# Altium project badgotron.PrjPcb
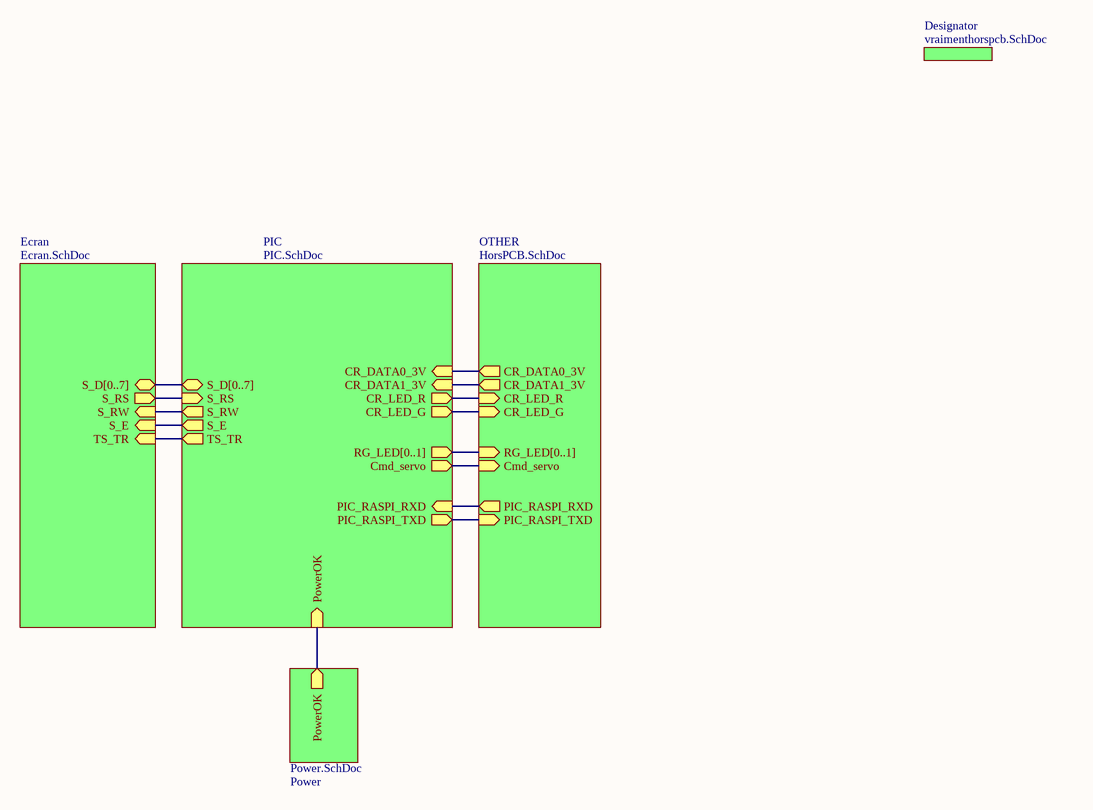
[diagram p0: Main.SchDoc]
6 sheets, 71 parts. Net scope: hierarchical (ports join the sheet entries above them; power ports are global).
Sheets:
  Main.SchDoc
    Designator = vraimenthorspcb.SchDoc
    Ecran = Ecran.SchDoc
    PIC = PIC.SchDoc
    OTHER = HorsPCB.SchDoc
    Power = Power.SchDoc

## Sheet Main.SchDoc
size A4

### Sub-sheets
Designator = vraimenthorspcb.SchDoc: no entries
Ecran = Ecran.SchDoc: S_D[0..7] (bidir), S_RS (out), S_RW (in), S_E (in), TS_TR (in)
OTHER = HorsPCB.SchDoc: CR_DATA0_3V (out), CR_DATA1_3V (out), CR_LED_R (in), CR_LED_G (in), RG_LED[0..1] (in), Cmd_servo (in), PIC_RASPI_TXD (in), PIC_RASPI_RXD (out)
PIC = PIC.SchDoc: CR_DATA0_3V (in), CR_DATA1_3V (in), CR_LED_R (out), CR_LED_G (out), RG_LED[0..1] (out), Cmd_servo (out), PowerOK (in), S_RS (in), S_RW (out), S_E (out), TS_TR (out), S_D[0..7] (bidir), PIC_RASPI_RXD (in), PIC_RASPI_TXD (out)
Power = Power.SchDoc: PowerOK (out)

### Nets
Cmd_servo: sheet PIC/Cmd_servo, sheet OTHER/Cmd_servo
CR_DATA0_3V: sheet PIC/CR_DATA0_3V, sheet OTHER/CR_DATA0_3V
CR_DATA1_3V: sheet PIC/CR_DATA1_3V, sheet OTHER/CR_DATA1_3V
CR_LED_G: sheet PIC/CR_LED_G, sheet OTHER/CR_LED_G
CR_LED_R: sheet PIC/CR_LED_R, sheet OTHER/CR_LED_R
PIC_RASPI_RXD: sheet PIC/PIC_RASPI_RXD, sheet OTHER/PIC_RASPI_RXD
PIC_RASPI_TXD: sheet PIC/PIC_RASPI_TXD, sheet OTHER/PIC_RASPI_TXD
PowerOK: sheet PIC/PowerOK, sheet Power/PowerOK
S_E: sheet Ecran/S_E, sheet PIC/S_E
S_RS: sheet Ecran/S_RS, sheet PIC/S_RS
S_RW: sheet Ecran/S_RW, sheet PIC/S_RW
TS_TR: sheet Ecran/TS_TR, sheet PIC/TS_TR
(unnamed): sheet Ecran/S_D[0..7], sheet PIC/S_D[0..7]
(unnamed): sheet PIC/RG_LED[0..1], sheet OTHER/RG_LED[0..1]

## Sheet vraimenthorspcb.SchDoc
size A
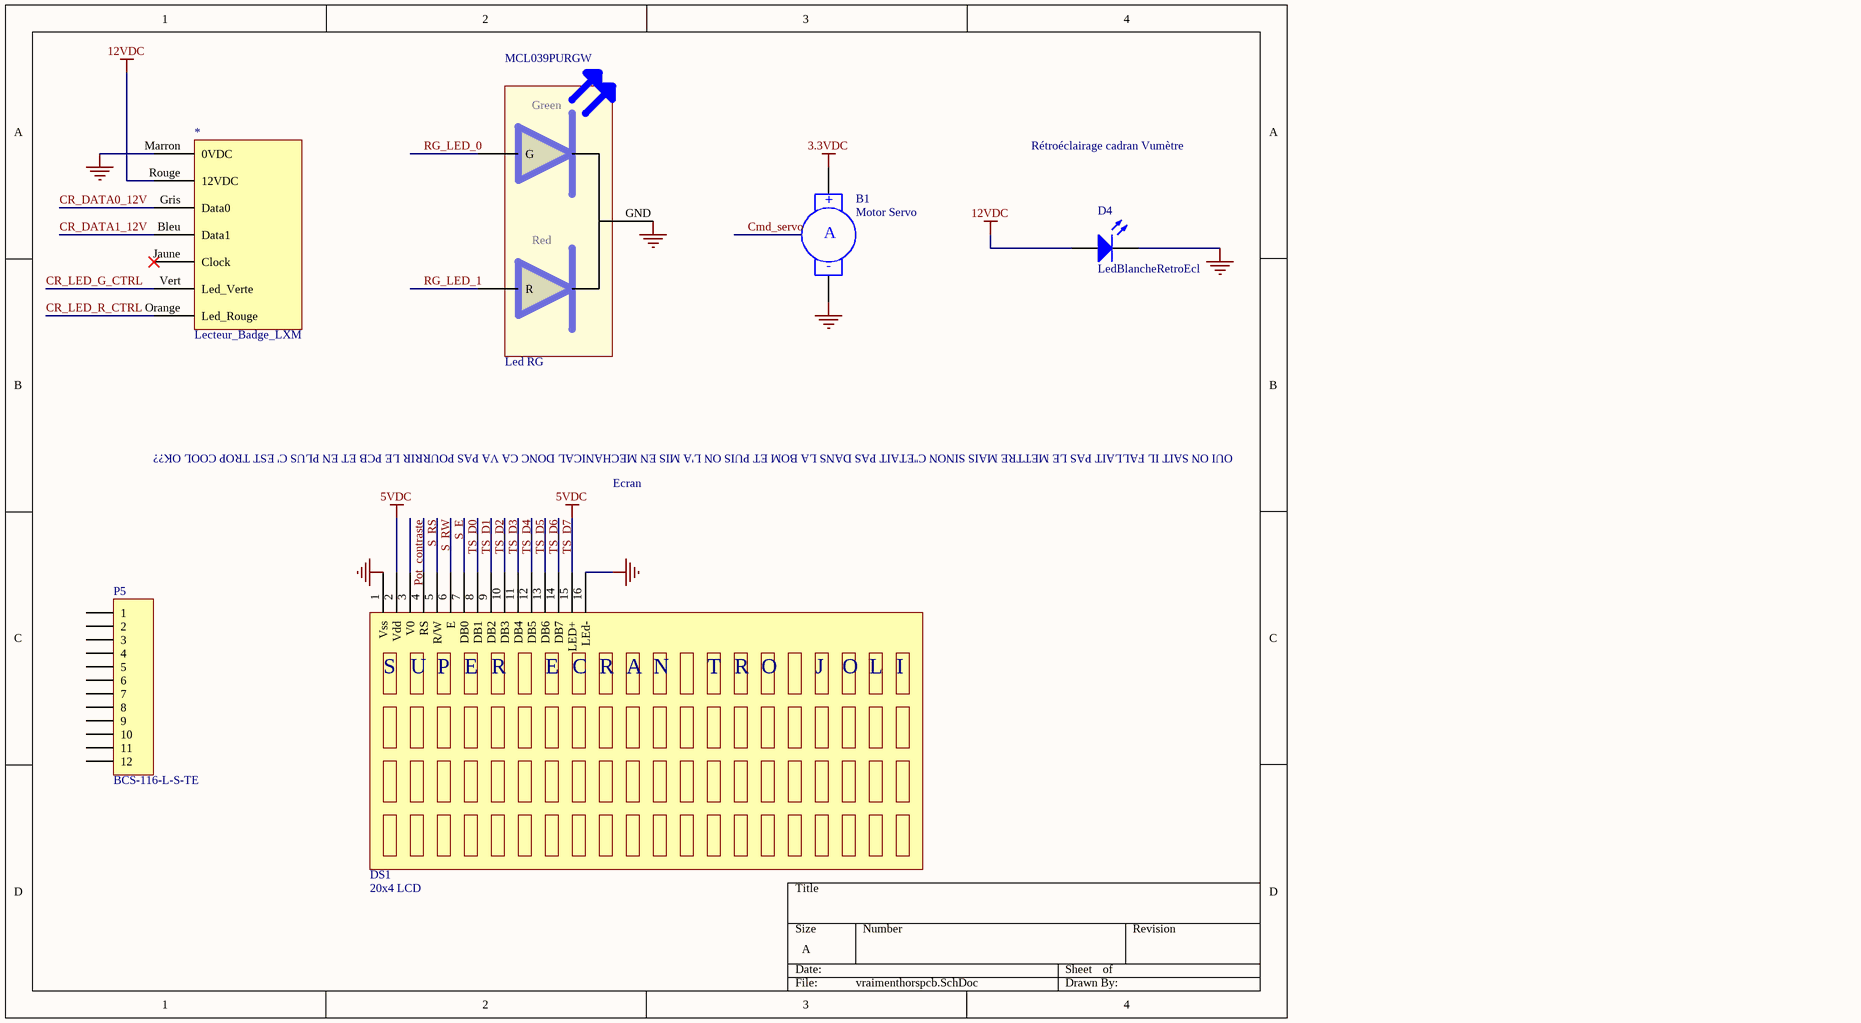
[diagram p1: vraimenthorspcb.SchDoc]

### Parts
*  Lecteur_Badge_LXM  (mechanical)
B1  Motor Servo  [RAD-0.4]  (mechanical)
D4  LedBlancheRetroEcl  [LED-0]  (mechanical)
DS1  20x4 LCD  (mechanical)
MCL039PURGW  Led RG  (mechanical)
P5  BCS-116-L-S-TE  [HDR1X12]  (mechanical)

### Nets
3.3VDC: B1.1(+)
5VDC: DS1.2(Vdd) DS1.15(LED+)
12VDC: *.Rouge(12VDC) D4.1(A)
GND: *.Marron(0VDC) B1.2(-) D4.2(K) DS1.1(Vss) DS1.16(LEd-) MCL039PURGW.GND
CR_DATA0_12V: *.Gris(Data0)
CR_DATA1_12V: *.Bleu(Data1)
CR_LED_G_CTRL: *.Vert(Led_Verte)
CR_LED_R_CTRL: *.Orange(Led_Rouge)
Pot_contraste: DS1.3(V0)
RG_LED_0: MCL039PURGW.G
RG_LED_1: MCL039PURGW.R
S_E: DS1.6(E)
S_RS: DS1.4(RS)
S_RW: DS1.5(R/W)
TS_D0: DS1.7(DB0)
TS_D1: DS1.8(DB1)
TS_D2: DS1.9(DB2)
TS_D3: DS1.10(DB3)
TS_D4: DS1.11(DB4)
TS_D5: DS1.12(DB5)
TS_D6: DS1.13(DB6)
TS_D7: DS1.14(DB7)

Not connected (* = marked no-connect by the designer): * Jaune(Clock)*; P5 1 2 3 4 5 6 7 8 9 10 11 12

### Notes on the sheet
- Rétroéclairage cadran Vumètre
- Ecran
- OUI ON SAIT IL FALLAIT PAS LE METTRE MAIS SINON C''ETAIT PAS DANS LA BOM ET PUIS ON L'A MIS EN MECHANICAL DONC CA VA PAS POURRIR LE PCB ET EN PLUS C' EST TROP COOL OK??
- (in symbol MC42008A6W-FPTLW) S; U; P; R; C; A; N; T; O; J; L; I
- (in symbol MCL039PURGW) Green; Red
- (in symbol Motor Servo) A

### Library data of the parts
* = Lecteur_Badge_LXM: Fournisseur: Gregoire; Fabricant: Stid-Security; Ref.Fournisseur: :); Ref.Fabricant: LXM_WIEGAND44b
B1 = Motor Servo: Servo Motor; Fournisseur: Olimex; Ref.Fournisseur: MS-R-1.3-9; Fabricant: Olimex; Ref.Fabricant: MS-R-1.3-9
D4 = LED0: LED Blanche retro vumetre; Fournisseur: BARBIE; Fabricant: N/A; Ref.Fabricant: N/A; Ref.Fournisseur: N/A
DS1 = MC42008A6W-FPTLW: Fournisseur: Farnell; Ref.Fournisseur: 2606880; Fabricant: Midas; Ref.Fabricant: MC42008A6W-FPTLW
MCL039PURGW = MCL039PURGW: Fournisseur: Farnell; Fabricant: Multicomp; Ref.Fournisseur: 1581194; Ref.Fabricant: MCL039PURGW
P5 = Header 12: Header, 12-Pin; Fournisseur: Farnell; Ref.Fournisseur: 1667483; Fabricant: Samtec; Ref.Fabricant: BCS-116-L-S-TE

## Sheet Ecran.SchDoc
size A
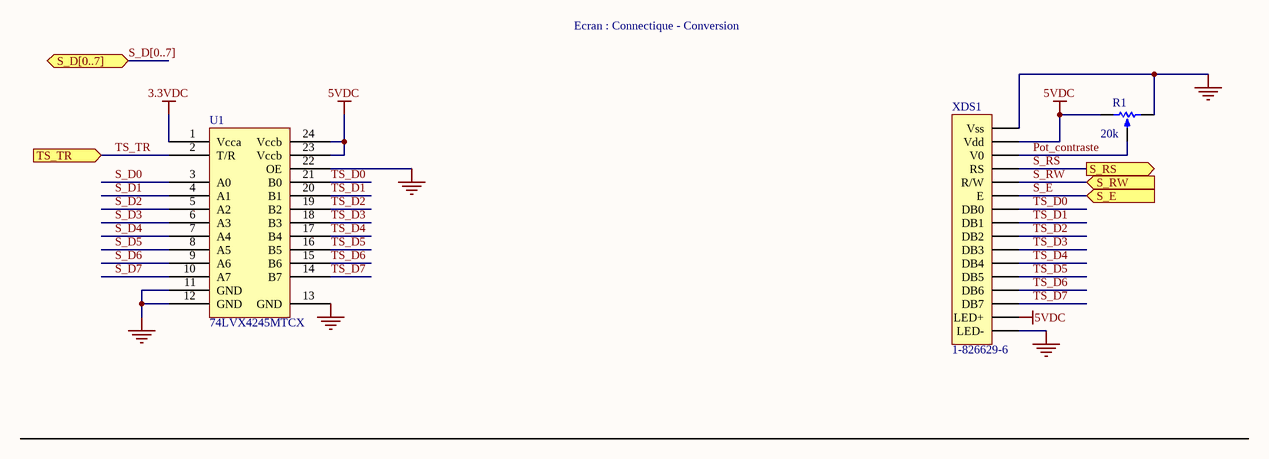
[diagram p2: Ecran.SchDoc]

### Parts
R1  20k  [VR5]
U1  74LVX4245MTCX
XDS1  1-826629-6  [HDR1X16]

### Ports
S_D[0..7] (bidir), S_E (in), S_RS (out), S_RW (in), TS_TR (in)

### Nets
3.3VDC: U1.1(Vcca)
5VDC: R1.1(TOP) U1.23(Vccb) U1.24(Vccb) XDS1.2(Vdd) XDS1.15(LED+)
GND: R1.2(BOT) U1.11(GND) U1.12(GND) U1.13(GND) U1.22(OE) XDS1.1(Vss) XDS1.16(LED-)
Pot_contraste: R1.3(TAP) XDS1.3(V0)
S_D0: U1.3(A0)
S_D1: U1.4(A1)
S_D2: U1.5(A2)
S_D3: U1.6(A3)
S_D4: U1.7(A4)
S_D5: U1.8(A5)
S_D6: U1.9(A6)
S_D7: U1.10(A7)
S_E: XDS1.6(E) ; port S_E
S_RS: XDS1.4(RS) ; port S_RS
S_RW: XDS1.5(R/W) ; port S_RW
TS_D0: U1.21(B0) XDS1.7(DB0)
TS_D1: U1.20(B1) XDS1.8(DB1)
TS_D2: U1.19(B2) XDS1.9(DB2)
TS_D3: U1.18(B3) XDS1.10(DB3)
TS_D4: U1.17(B4) XDS1.11(DB4)
TS_D5: U1.16(B5) XDS1.12(DB5)
TS_D6: U1.15(B6) XDS1.13(DB6)
TS_D7: U1.14(B7) XDS1.14(DB7)
TS_TR: U1.2(T/R) ; port TS_TR

### Buses and harness runs
bus S_D[0..7] = port S_D[0..7]

### Notes on the sheet
- Ecran : Connectique - Conversion

### Library data of the parts
R1 = RPot: Potentiometer; Fournisseur: Farnell; Ref.Fournisseur: 9609822; Ref.Fabricant: M63S203KB40; Fabricant: VISHAY
U1 = 74LVX4245MTCX: Bus Transceiver; Fabricant: ON SEMICONDUCTOR; Fournisseur: Farnell; Ref.Fournisseur: 1467357; Ref.Fabricant: 74LVX4245MTCX
XDS1 = Header 16: Header, 16-Pin; Fournisseur: Farnell; Fabricant: AMP-TE CONNECTIVITY; Ref.Fournisseur: 1248124; Ref.Fabricant: 1-826629-6

## Sheet PIC.SchDoc
size A4
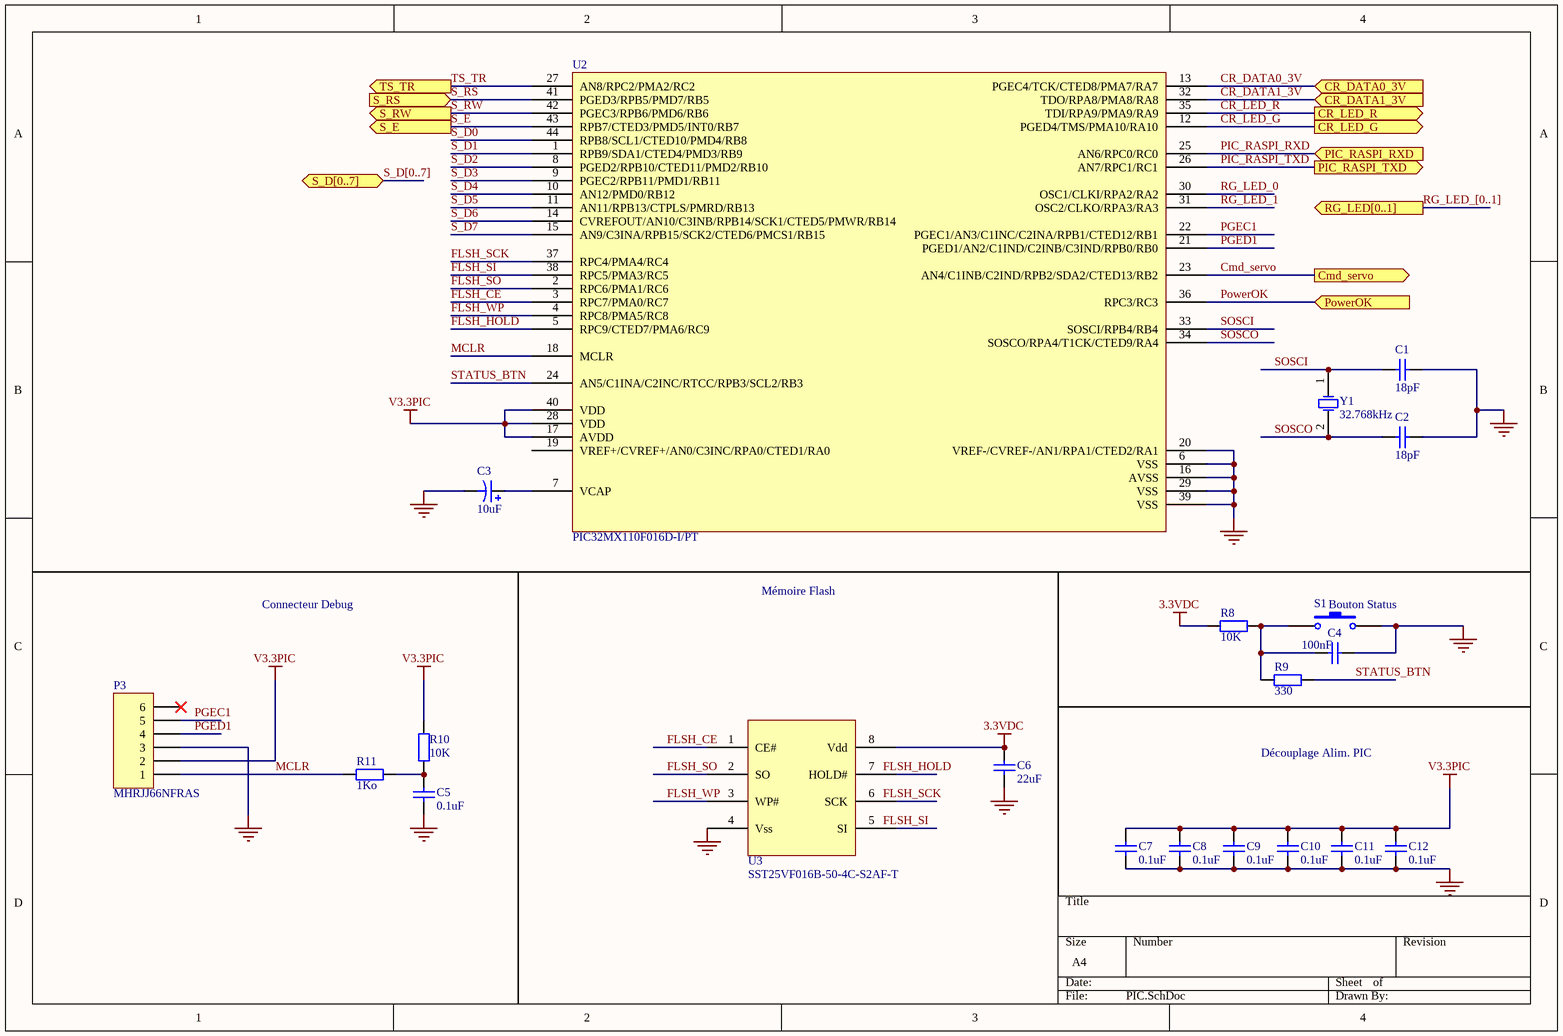
[diagram p3: PIC.SchDoc]

### Parts
C1  18pF  [RAD-0.3]
C2  18pF  [RAD-0.3]
C3  10uF  [RB7.6-15]
C4  100nF  [RAD-0.3]
C5  0.1uF  [RAD-0.3]
C6  22uF  [RAD-0.3]
C7  0.1uF  [RAD-0.3]
C8  0.1uF  [RAD-0.3]
C9  0.1uF  [RAD-0.3]
C10  0.1uF  [RAD-0.3]
C11  0.1uF  [RAD-0.3]
C12  0.1uF  [RAD-0.3]
P3  MHRJJ66NFRAS  [HDR1X6]
R8  10K  [AXIAL-0.4]
R9  330  [AXIAL-0.4]
R10  10K  [AXIAL-0.4]
R11  1Ko  [AXIAL-0.4]
S1  Bouton Status  [SPST-2]  (value not drawn)
U2  PIC32MX110F016D-I/PT
U3  SST25VF016B-50-4C-S2AF-T
Y1  32.768kHz  [R38]

### Ports
Cmd_servo (out), CR_DATA0_3V (in), CR_DATA1_3V (in), CR_LED_G (out), CR_LED_R (out), PIC_RASPI_RXD (in), PIC_RASPI_TXD (out), PowerOK (in), RG_LED[0..1] (out), S_D[0..7] (bidir), S_E (out), S_RS (in), S_RW (out), TS_TR (out)

### Nets
3.3VDC: C6.2 R8.1 U3.8(Vdd)
GND: C1.1 C2.1 C3.2 C4.2 C5.1 C6.1 C7.1 C8.1 C9.1 C10.1 C11.1 C12.1 P3.3 S1.2 U2.6(VSS) U2.16(AVSS) U2.20(VREF-/CVREF-/AN1/RPA1/CTED2/RA1) U2.29(VSS) U2.39(VSS) U3.4(Vss)
V3.3PIC: C7.2 C8.2 C9.2 C10.2 C11.2 C12.2 P3.2 R10.2 U2.17(AVDD) U2.28(VDD) U2.40(VDD)
Cmd_servo: U2.23(AN4/C1INB/C2IND/RPB2/SDA2/CTED13/RB2) ; port Cmd_servo
CR_DATA0_3V: U2.13(PGEC4/TCK/CTED8/PMA7/RA7) ; port CR_DATA0_3V
CR_DATA1_3V: U2.32(TDO/RPA8/PMA8/RA8) ; port CR_DATA1_3V
CR_LED_G: U2.12(PGED4/TMS/PMA10/RA10) ; port CR_LED_G
CR_LED_R: U2.35(TDI/RPA9/PMA9/RA9) ; port CR_LED_R
FLSH_CE: U2.3(RPC7/PMA0/RC7) U3.1(CE#)
FLSH_HOLD: U2.5(RPC9/CTED7/PMA6/RC9)
FLSH_SCK: U2.37(RPC4/PMA4/RC4)
FLSH_SI: U2.38(RPC5/PMA3/RC5)
FLSH_SO: U2.2(RPC6/PMA1/RC6) U3.2(SO)
FLSH_WP: U2.4(RPC8/PMA5/RC8) U3.3(WP#)
MCLR: P3.1 R11.2 U2.18(MCLR)
PGEC1: P3.5 U2.22(PGEC1/AN3/C1INC/C2INA/RPB1/CTED12/RB1)
PGED1: P3.4 U2.21(PGED1/AN2/C1IND/C2INB/C3IND/RPB0/RB0)
PIC_RASPI_RXD: U2.25(AN6/RPC0/RC0) ; port PIC_RASPI_RXD
PIC_RASPI_TXD: U2.26(AN7/RPC1/RC1) ; port PIC_RASPI_TXD
PowerOK: U2.36(RPC3/RC3) ; port PowerOK
RG_LED_0: U2.30(OSC1/CLKI/RPA2/RA2)
RG_LED_1: U2.31(OSC2/CLKO/RPA3/RA3)
S_D0: U2.44(RPB8/SCL1/CTED10/PMD4/RB8)
S_D1: U2.1(RPB9/SDA1/CTED4/PMD3/RB9)
S_D2: U2.8(PGED2/RPB10/CTED11/PMD2/RB10)
S_D3: U2.9(PGEC2/RPB11/PMD1/RB11)
S_D4: U2.10(AN12/PMD0/RB12)
S_D5: U2.11(AN11/RPB13/CTPLS/PMRD/RB13)
S_D6: U2.14(CVREFOUT/AN10/C3INB/RPB14/SCK1/CTED5/PMWR/RB14)
S_D7: U2.15(AN9/C3INA/RPB15/SCK2/CTED6/PMCS1/RB15)
S_E: U2.43(RPB7/CTED3/PMD5/INT0/RB7) ; port S_E
S_RS: U2.41(PGED3/RPB5/PMD7/RB5) ; port S_RS
S_RW: U2.42(PGEC3/RPB6/PMD6/RB6) ; port S_RW
SOSCI: C1.2 U2.33(SOSCI/RPB4/RB4) Y1.1(OSC1)
SOSCO: C2.2 U2.34(SOSCO/RPA4/T1CK/CTED9/RA4) Y1.2(OSC2)
STATUS_BTN: R9.2 U2.24(AN5/C1INA/C2INC/RTCC/RPB3/SCL2/RB3)
TS_TR: U2.27(AN8/RPC2/PMA2/RC2) ; port TS_TR
NetC3_1: C3.1 U2.7(VCAP)
NetC4_1: C4.1 R8.2 R9.1 S1.1
NetC5_2: C5.2 R10.1 R11.1

Not connected (* = marked no-connect by the designer): P3 6*; U2 19(VREF+/CVREF+/AN0/C3INC/RPA0/CTED1/RA0); U3 5(SI) 6(SCK) 7(HOLD#)

### Buses and harness runs
bus RG_LED_[0..1] = port RG_LED[0..1]
bus S_D[0..7] = port S_D[0..7]

### Notes on the sheet
- Connecteur Debug
- Mémoire Flash
- (near S1) Bouton Status
- Découplage Alim. PIC
- Labels drawn without touching a wire or pin: FLSH_HOLD, FLSH_SCK, FLSH_SI

### Library data of the parts
C1 C2 = Cap: Capacitor; Fournisseur: Farnell; Fabricant: AVX; Ref.Fabricant: 02013A180JAT2A; Ref.Fournisseur: 1740563
C3 = Cap Pol1: Fournisseur: Farnell; Ref.Fournisseur: 2353238; Ref.Fabricant: TL3C106K025C0450..; Fabricant: VISHAY
C4 = Cap: Capacitor; Fournisseur: Farnell; Ref.Fournisseur: 2812613; Fabricant: WURTH ELECTRONIK; Ref.Fabricant: 885342211005; Value: 100nF
C5 C7-C12 = Cap: Capacitor; Fournisseur: Farnell; Fabricant: Multicomp; Ref.Fabricant: MCY4C3B104M160CT; Ref.Fournisseur: 2310273; Value: 0.1uF
C6 = Cap: Cout_Reg_3.3v; Fournisseur: Farnell; Fabricant: AVX; Ref.Fabricant: 12103D226KAT2A; Ref.Fournisseur: 1833829; Value: 22uF
P3 = Header 6: PortRJ12_debug; Fournisseur: Farnell; Fabricant: MH Connectors; Ref.Fournisseur: 3938372; Ref.Fabricant: MHRJJ66NFRAS
R8 = Res2: Resistor; Fabricant: TE CONNECTIVITY; Fournisseur: Farnell; Ref.Fabricant: CPF0201D10KC1; Ref.Fournisseur: 2117887
R9 = Res2: Resistor; Fabricant: TE Connectivity; Fournisseur: Farnell; Ref.Fabricant: RN73C1J232RBTDF; Ref.Fournisseur: 2687973
R10 = Res2: Resistor; Fournisseur: Farnell; Fabricant: TE CONNECTIVITY; Ref.Fabricant: CPF0201D10KC1; Ref.Fournisseur: 2117887; Value: 10k
R11 = Res2: Resistor; Value: 1K; Fournisseur: Farnell; Fabricant: TE CONNECTIVITY; Ref.Fabricant: CPF0201D1K0E1; Ref.Fournisseur: 2117780
S1 = SW-PB: Switch; Fournisseur: Farnell; Fabricant: RAFI; Ref.Fabricant: 1.10.001.001/0205; Ref.Fournisseur: 9927360
U2 = PIC32: Fournisseur: Farnell; Fabricant: MICROCHIP; Ref.Fournisseur: 2057068; Ref.Fabricant: PIC32MX110F016D-I/PT
U3 = Memoire: FLASH; Fournisseur: Farnell; Fabricant: Microchip; Ref.Fournisseur: 2810109; Ref.Fabricant: SST25VF016B-50-4C-S2AF-T
Y1 = XTAL: Crystal Oscillator; Fournisseur: Farnell; Fabricant: ABRACON; Ref.Fabricant: ABS07-32.768KHZ-7-T; Ref.Fournisseur: 1838935

## Sheet HorsPCB.SchDoc
size A4
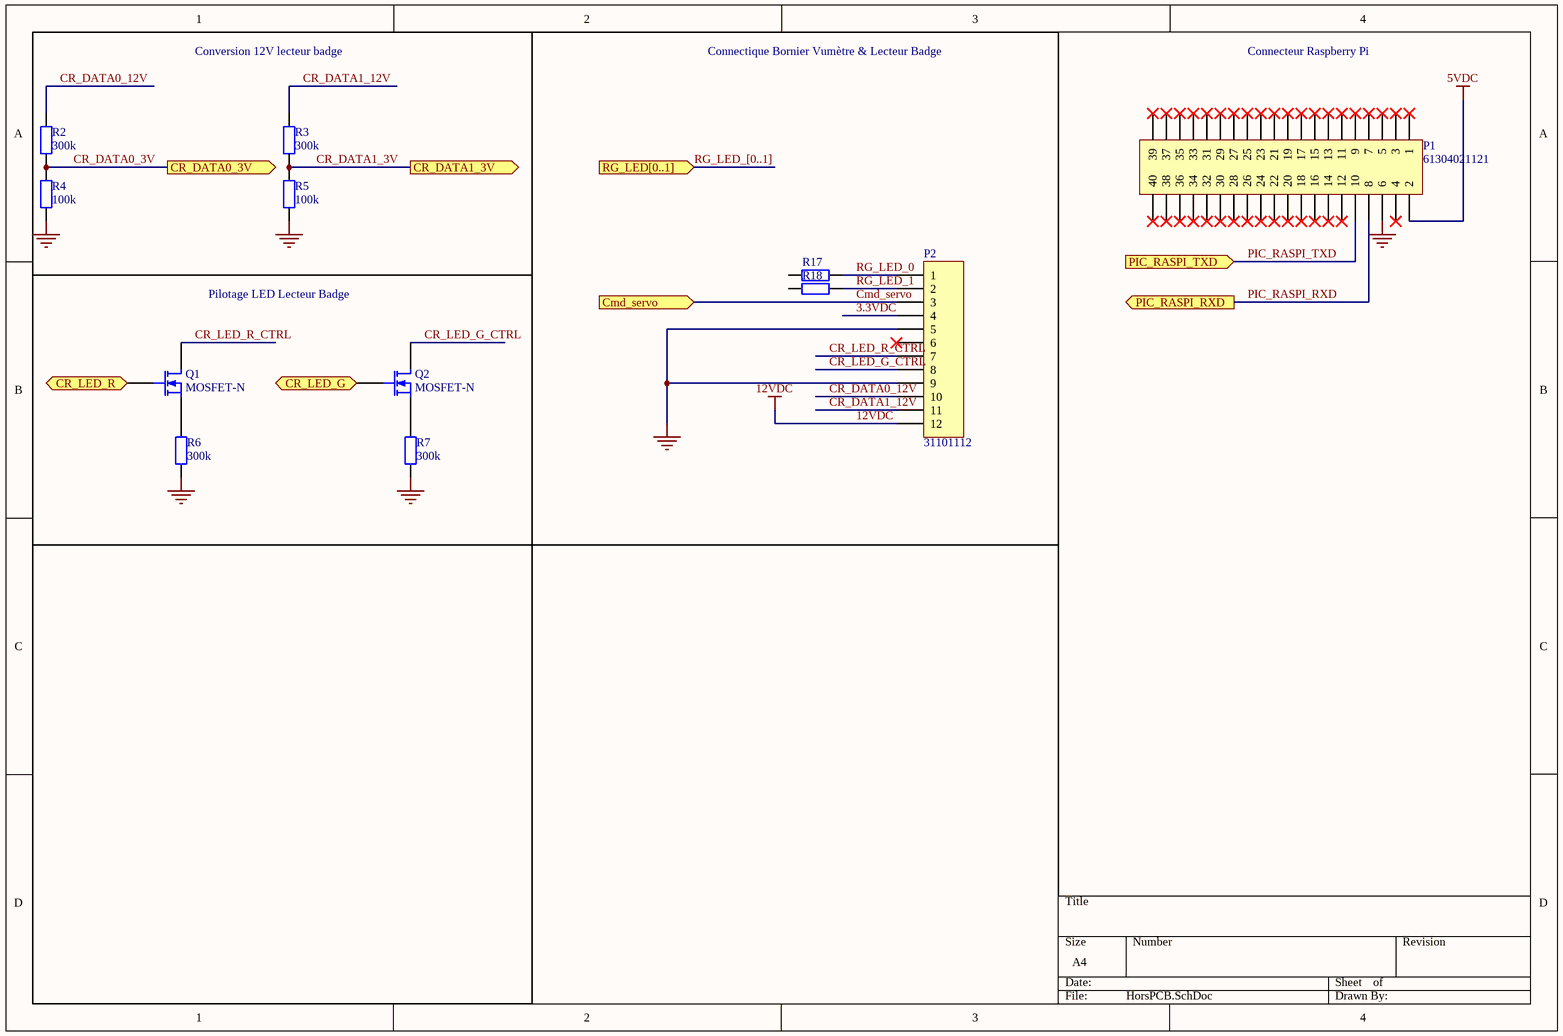
[diagram p4: HorsPCB.SchDoc]

### Parts
P1  61304021121  [HDR2X20]
P2  31101112  [HDR1X12]
Q1  MOSFET-N  [E3]
Q2  MOSFET-N  [E3]
R2  300k  [AXIAL-0.4]
R3  300k  [AXIAL-0.4]
R4  100k  [AXIAL-0.4]
R5  100k  [AXIAL-0.4]
R6  300k  [AXIAL-0.4]
R7  300k  [AXIAL-0.4]
R17  60.4  [AXIAL-0.4]  (value not drawn)
R18  75  [AXIAL-0.4]  (value not drawn)

### Ports
Cmd_servo (in), CR_DATA0_3V (out), CR_DATA1_3V (out), CR_LED_G (in), CR_LED_R (in), PIC_RASPI_RXD (out), PIC_RASPI_TXD (in), RG_LED[0..1] (in)

### Nets
5VDC: P1.2
12VDC: P2.12
GND: P1.6 P2.5 P2.9 R4.1 R5.1 R6.1 R7.1
3.3VDC: P2.4
Cmd_servo: P2.3 ; port Cmd_servo
CR_DATA0_3V: R2.1 R4.2 ; port CR_DATA0_3V
CR_DATA0_12V: P2.10 R2.2
CR_DATA1_3V: R3.1 R5.2 ; port CR_DATA1_3V
CR_DATA1_12V: P2.11 R3.2
CR_LED_G: Q2.2(G) ; port CR_LED_G
CR_LED_G_CTRL: P2.8 Q2.1(D)
CR_LED_R: Q1.2(G) ; port CR_LED_R
CR_LED_R_CTRL: P2.7 Q1.1(D)
PIC_RASPI_RXD: P1.8 ; port PIC_RASPI_RXD
PIC_RASPI_TXD: P1.10 ; port PIC_RASPI_TXD
RG_LED_0: P2.1 R17.2
RG_LED_1: P2.2 R18.2
NetQ1_3: Q1.3(S) R6.2
NetQ2_3: Q2.3(S) R7.2

Not connected (* = marked no-connect by the designer): P1 1* 3* 4* 5* 7* 9* 11* 12* 13* 14* 15* 16* 17* 18* 19* 20* 21* 22* 23* 24* 25* 26* 27* 28* 29* 30* 31* 32* 33* 34* 35* 36* 37* 38* 39* 40*; P2 6*; R17 1; R18 1

### Buses and harness runs
bus RG_LED_[0..1] = port RG_LED[0..1]

### Notes on the sheet
- Conversion 12V lecteur badge
- Connectique Bornier Vumètre & Lecteur Badge
- Connecteur Raspberry Pi
- Pilotage LED Lecteur Badge

### Library data of the parts
P1 = Header 20X2: Header, 20-Pin, Dual row; Fournisseur: Farnell; Fabricant: WURTH ELECTRONIK; Ref.Fournisseur: 2356148; Ref.Fabricant: 61304021121
P2 = Header 12: Header, 12-Pin; Fournisseur: Farnell; Fabricant: METZ CONNECT; Ref.Fournisseur: 1909750; Ref.Fabricant: 31101112
Q1 Q2 = MOSFET-N: N-Channel MOSFET; Fournisseur: Farnell; Ref.Fournisseur: 2760371; Fabricant: Nexperia; Ref.Fabricant: BUK7M42-60EX
R2 R3 R6 R7 = Res2: Resistor; Fournisseur: Farnell; Ref.Fournisseur: 2074433; Fabricant: MULTICOMP; Ref.Fabricant: MCSR08X3003FTL; Value: 300k
R4 R5 = Res2: Resistor; Fournisseur: Farnell; Ref.Fournisseur: 2447226; Fabricant: MULTICOMP; Ref.Fabricant: MCWR06X1003FTL; Value: 100k
R17 = Res2: Resistor; Value: 60.4o; Fournisseur: Farnell; Fabricant: TE CONNECTIVITY; Ref.Fabricant: RP73PF1E60R4BTDF; Ref.Fournisseur: 2838800
R18 = Res2: Resistor; Value: 75o; Fournisseur: Farnell; Fabricant: TE CONNECTIVITY; Ref.Fabricant: CPF0805B75RE1; Ref.Fournisseur: 1697415

## Sheet Power.SchDoc
size A4
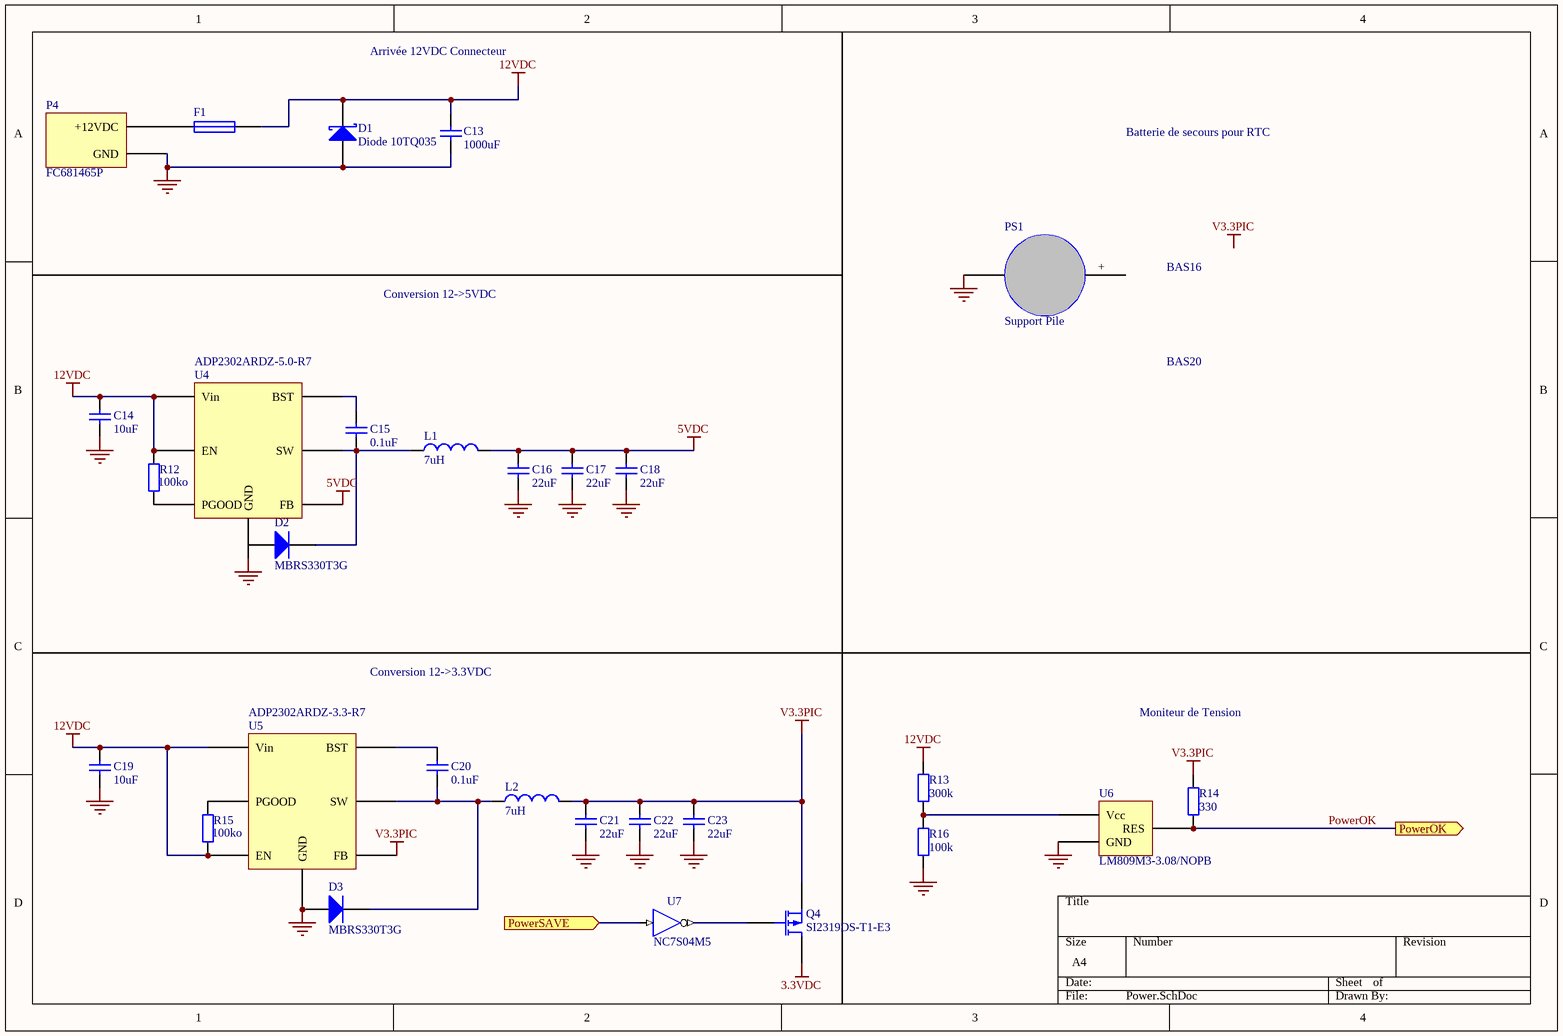
[diagram p5: Power.SchDoc]

### Parts
C13  1000uF  [RAD-0.3]
C14  10uF  [RAD-0.3]
C15  0.1uF  [RAD-0.3]
C16  22uF  [RAD-0.3]
C17  22uF  [RAD-0.3]
C18  22uF  [RAD-0.3]
C19  10uF  [RAD-0.3]
C20  0.1uF  [RAD-0.3]
C21  22uF  [RAD-0.3]
C22  22uF  [RAD-0.3]
C23  22uF  [RAD-0.3]
D1  Diode 10TQ035  [TO-220AC]
D2  MBRS330T3G  [SMC]
D3  MBRS330T3G  [SMC]
F1  Fuse 1  [PIN-W2/E2.8]  (value not drawn)
L1  7uH  [0402-A]
L2  7uH  [0402-A]
P4  FC681465P
PS1  Support Pile
Q4  SI2319DS-T1-E3  [E3]
R12  100ko  [AXIAL-0.4]
R13  300k  [AXIAL-0.4]
R14  330  [AXIAL-0.4]
R15  100ko  [AXIAL-0.4]
R16  100k  [AXIAL-0.4]
U4  ADP2302ARDZ-5.0-R7
U5  ADP2302ARDZ-3.3-R7
U6  LM809M3-3.08/NOPB
U7  NC7S04M5

### Ports
PowerOK (out), PowerSAVE (in)

### Nets
3.3VDC: Q4.1(D)
5VDC: C16.1 C17.1 C18.1 L1.2 U4.FB
12VDC: C13.2 C14.1 C19.1 D1.1(K) F1.2 R12.2 R13.2 R15.1 U4.EN U4.Vin U5.EN U5.Vin
GND: C13.1 C14.2 C16.2 C17.2 C18.2 C19.2 C21.2 C22.2 C23.2 D1.3(A) D3.1(A) P4.GND PS1.- R16.1 U4.GND U5.GND U6.GND
V3.3PIC: C21.1 C22.1 C23.1 L2.2 Q4.3(S) R14.2 U5.FB
PowerOK: R14.1 U6.RES ; port PowerOK
NetC15_1: C15.1 U4.BST
NetC15_2: C15.2 D2.2(K) L1.1 U4.SW
NetC20_1: C20.1 U5.BST
NetC20_2: C20.2 D3.2(K) L2.1 U5.SW
NetF1_1: F1.1 P4.+12VDC
NetQ4_2: Q4.2(G) U7.O
NetR12_1: R12.1 U4.PGOOD
NetR13_1: R13.1 R16.2 U6.Vcc
NetR15_2: R15.2 U5.PGOOD
NetU7_I: U7.I ; port PowerSAVE

Not connected (* = marked no-connect by the designer): D2 1(A); PS1 +

### Notes on the sheet
- Arrivée 12VDC Connecteur
- Batterie de secours pour RTC
- Conversion 12->5VDC
- BAS16
- BAS20
- Conversion 12->3.3VDC
- Moniteur de Tension
- Labels drawn without touching a wire or pin: PowerOK, V3.3PIC

### Library data of the parts
C13 = Cap: Capacitor; Ref.Fournisseur: 1902972; Fournisseur: Farnell; Fabricant: Multicomp; Ref.Fabricant: MCGLR16V108M10X16
C14 = Cap: Cin_Reg_5v; Fournisseur: Farnell; Fabricant: KEMET; Ref.Fabricant: C1210C106K3RACTU; Ref.Fournisseur: 1358512; Value: 10uF
C15 = Cap: Cbst_Reg_5v; Value: 0.1000000001uF; Fournisseur: Farnell; Fabricant: TDK; Ref.Fabricant: CGA2B3X7R1E104K050BB; Ref.Fournisseur: 2210820
C16-C18 C21-C23 = Cap: as C6 on sheet PIC; Value: 22uF
C19 = Cap: Cin_Reg_3v; Fournisseur: Farnell; Fabricant: KEMET; Ref.Fabricant: C1210C106K3RACTU; Ref.Fournisseur: 1358512; Value: 10uF
C20 = Cap: Cbst_Reg_3.3v; Value: 0.10uF; Fournisseur: Farnell; Fabricant: TDK; Ref.Fabricant: CGA2B3X7R1E104K050BB; Ref.Fournisseur: 2210820
D1 = Diode 10TQ035: Diode Zenner; Fournisseur: Farnell; Ref.Fournisseur: 2453991; Fabricant: ON SEMICONDUCTOR; Ref.Fabricant: MM3Z15VB
D2 D3 = Diode: Schottky; Fournisseur: Farnell; Ref.Fournisseur: 1459078; Fabricant: OnSemiconductor; Ref.Fabricant: MBRS330T3G
F1 = Fuse 1: Fuse; Fournisseur: Farnell; Ref.Fournisseur: 1596504; Fabricant: Littelfuse; Ref.Fabricant: 39515000000
L1 = Inductor: L_Reg_5v; Fabricant: Coilcraft; Ref.Fabricant: MSS1038-702NLC; Fournisseur: Farnell; Ref.Fournisseur: 2288224; Value: 7uH
L2 = Inductor: L_Reg_3.3v; Fabricant: Coilcraft; Ref.Fabricant: MSS1038-702NLC; Fournisseur: Farnell; Ref.Fournisseur: 2288224; Value: 7uH
P4 = FC68148S: Power connector; Fournisseur: Farnell; Ref.Fournisseur: 1854512; Fabricant: CLIFF; Ref.Fabricant: FC681465P
PS1 = SMTU-1225-1-LF: Fournisseur: Farnell; Fabricant: Renata; Ref.Fournisseur: 1216353; Ref.Fabricant: SMTU-1225-1-LF
Q4 = MOSFET-P: P-Channel MOSFET; Fabricant: VISHAY; Ref.Fournisseur: 1838990; Fournisseur: Farnell; Ref.Fabricant: SI2319DS-T1-E3
R12 R15 = Res2: Resistor; Fournisseur: Farnell; Ref.Founisseur: 2447226; Fabricant: Multicomp; Ref.Fabricant: MCWR06X1003FTL
R13 = Res2: as R2 on sheet HorsPCB; Value: 300k
R14 = Res2: as R9 on sheet PIC
R16 = Res2: as R4 on sheet HorsPCB; Value: 100k
U4 = ADP2302ARDZ-5.0-R7: Convert. 5v; Fournisseur: Farnell; Ref.Fournisseur: 2727507; Fabricant: Analog Devices; Ref.Fabricant: ADP2302ARDZ-5.0-R7
U5 = ADP2302ARDZ-3.3-R7: Convert.3.3; Fournisseur: Farnell; Ref.Fournisseur: 2376914; Fabricant: Analog Devices; Ref.Fabricant: ADP2302ARDZ-3.3-R7
U6 = LM809M3-3.08/NOPB: Voltage Monitor; Fournisseur: Farnell; Ref.Fournisseur: 2352609; Fabricant: TEXAS INSTRUMENTS; Ref.Fabricant: LM809M3-3.08/NOPB
U7 = INV: Inverter; Fabricant: ON SEMICONDUCTOR; Ref.Fournisseur: 1014133; Fournisseur: Farnell; Ref.Fabricant: NC7S04M5

## Nets that join several sheets
3.3VDC: vraimenthorspcb (B1.1), Ecran (U1.1), PIC (C6.2 R8.1 U3.8), Power (Q4.1)
5VDC: vraimenthorspcb (DS1.2 DS1.15), Ecran (5 pins), HorsPCB (P1.2), Power (5 pins)
12VDC: vraimenthorspcb (*.Rouge D4.1), HorsPCB (P2.12), Power (12 pins)
GND: vraimenthorspcb (6 pins), Ecran (7 pins), PIC (20 pins), HorsPCB (7 pins), Power (17 pins)
V3.3PIC: PIC (11 pins), Power (7 pins)
Cmd_servo: PIC (U2.23), HorsPCB (P2.3)
CR_DATA0_3V: PIC (U2.13), HorsPCB (R2.1 R4.2)
CR_DATA1_3V: PIC (U2.32), HorsPCB (R3.1 R5.2)
CR_LED_G: PIC (U2.12), HorsPCB (Q2.2)
CR_LED_R: PIC (U2.35), HorsPCB (Q1.2)
PIC_RASPI_RXD: PIC (U2.25), HorsPCB (P1.8)
PIC_RASPI_TXD: PIC (U2.26), HorsPCB (P1.10)
PowerOK: PIC (U2.36), Power (R14.1 U6.RES)
RG_LED_0: PIC (U2.30), HorsPCB (P2.1 R17.2)
RG_LED_1: PIC (U2.31), HorsPCB (P2.2 R18.2)
S_D0: Ecran (U1.3), PIC (U2.44)
S_D1: Ecran (U1.4), PIC (U2.1)
S_D2: Ecran (U1.5), PIC (U2.8)
S_D3: Ecran (U1.6), PIC (U2.9)
S_D4: Ecran (U1.7), PIC (U2.10)
S_D5: Ecran (U1.8), PIC (U2.11)
S_D6: Ecran (U1.9), PIC (U2.14)
S_D7: Ecran (U1.10), PIC (U2.15)
S_E: Ecran (XDS1.6), PIC (U2.43)
S_RS: Ecran (XDS1.4), PIC (U2.41)
S_RW: Ecran (XDS1.5), PIC (U2.42)
TS_TR: Ecran (U1.2), PIC (U2.27)